# Altium schematic sheet MCU.SchDoc: =ProjectTitle
size 420 x 297 mm; Address1: Address1; Address2: Address2; Address3: Address3; Address4: Address4; SheetNumber: 1; SheetTotal: 4; Scale: 1:1; DocumentType: Схема электрическая принципиальная
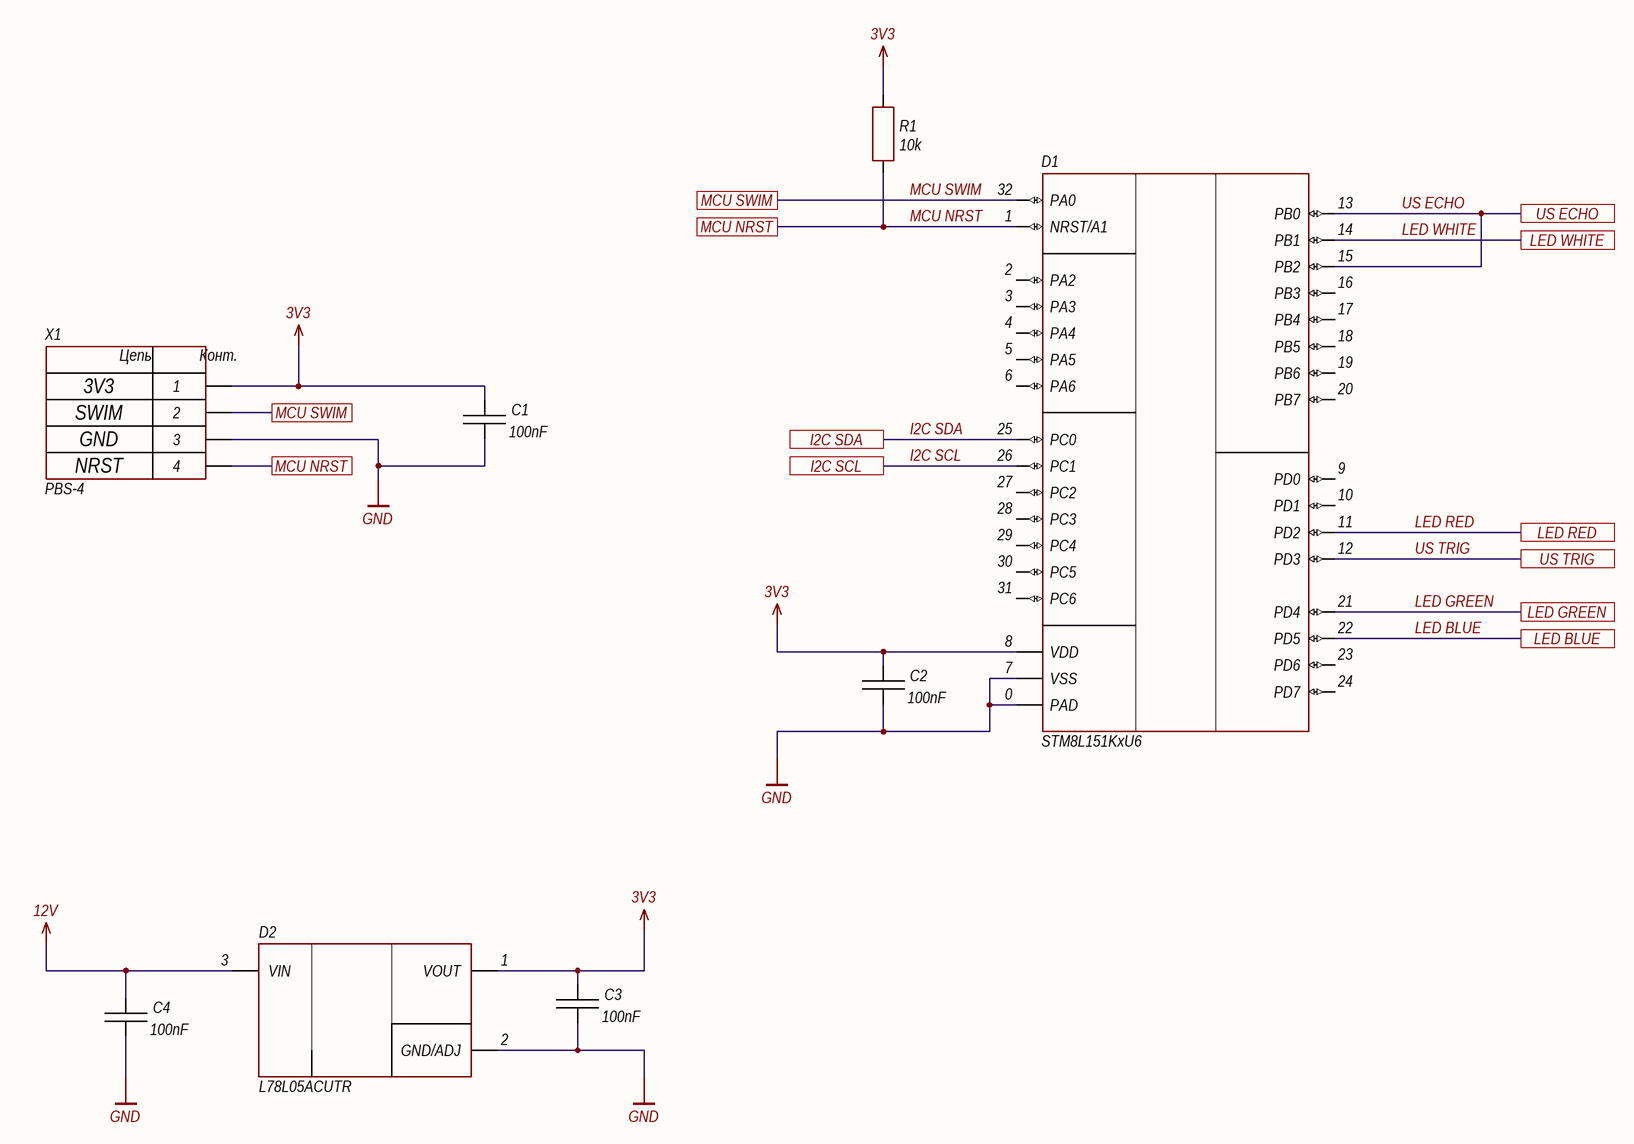
[diagram p0: MCU.SchDoc]

## Parts
C1  100nF  [CH0603C]
C2  100nF  [CH0603C]
C3  100nF  [CH0603C]
C4  100nF  [CH0603C]
D1  STM8L151KxU6  [32-UFQFPN]
D2  L78L05ACUTR  [SOT89_123]
R1  10k  [CH0603R]
X1  PBS-4  [CON: PBS-4]

## Ports
I2C SCL, I2C SDA, LED BLUE, LED GREEN, LED RED, LED WHITE, MCU NRST, MCU SWIM, US ECHO, US TRIG

## Nets
3V3: C1.2 C2.2 C3.2 D1.8(VDD) D2.1(VOUT) R1.2 X1.1
12V: C4.2 D2.3(VIN)
GND: C1.1 C2.1 C3.1 C4.1 D1.0(PAD) D1.7(VSS) D2.2(GND/ADJ) X1.3
I2C SCL: D1.26(PC1) ; port I2C SCL
I2C SDA: D1.25(PC0) ; port I2C SDA
LED BLUE: D1.22(PD5) ; port LED BLUE
LED GREEN: D1.21(PD4) ; port LED GREEN
LED RED: D1.11(PD2) ; port LED RED
LED WHITE: D1.14(PB1) ; port LED WHITE
MCU NRST: D1.1(NRST/A1) R1.1 X1.4 ; port MCU NRST
MCU SWIM: D1.32(PA0) X1.2 ; port MCU SWIM
US ECHO: D1.13(PB0) D1.15(PB2) ; port US ECHO
US TRIG: D1.12(PD3) ; port US TRIG

Not connected (* = marked no-connect by the designer): D1 2(PA2) 3(PA3) 4(PA4) 5(PA5) 6(PA6) 9(PD0) 10(PD1) 16(PB3) 17(PB4) 18(PB5) 19(PB6) 20(PB7) 23(PD6) 24(PD7) 27(PC2) 28(PC3) 29(PC4) 30(PC5) 31(PC6)

## Notes on the sheet
- 3V3
- SWIM
- GND
- NRST
- Перв. примен.
- Справ. №
- Подп. и дата
- Инв. № дубл.
- Взам. инв. №
- Разраб.
- Изм.
- Лист
- № докум.
- Подп.
- Дата
- Лит.
- Масса
- Масштаб
- Пров.
- Т.контр.
- Листов
- Инв. № подл.
- Утв.
- Н.контр.
- 2.106-A3
- Копировал
- Формат А3
- (in symbol 4-Connector) Цепь; Конт.

## Library data of the parts
C1-C4 = Capacitor: Manufacturer: *; Model: *; HelpURL: *; ComponentKind: *; Value: 100nF
D1 = STM8L151KxU6: STM8; Manufacturer: ST Microelectronics; Model: STM8L151GxU6; ComponentKind: UFQFPN28; HelpURL: https://ru.mouser.com/datasheet/2/389/stm8l151c4-956418.pdf
D2 = L78LxxACUTR: Step-down; Manufacturer: ST Microelectronics; Model: L78L05ACUTR; HelpURL: https://www.st.com/resource/en/datasheet/l78l.pdf; ComponentKind: SOT-89, 100mA
R1 = Resistor: Manufacturer: *; Model: *; HelpURL: *; ComponentKind: *; Value: 10k
X1 = 4-Connector: Model: PBS-4; Manufacturer: *; HelpURL: *; ComponentKind: *